# Altium schematic sheet Power.SchDoc
size A4
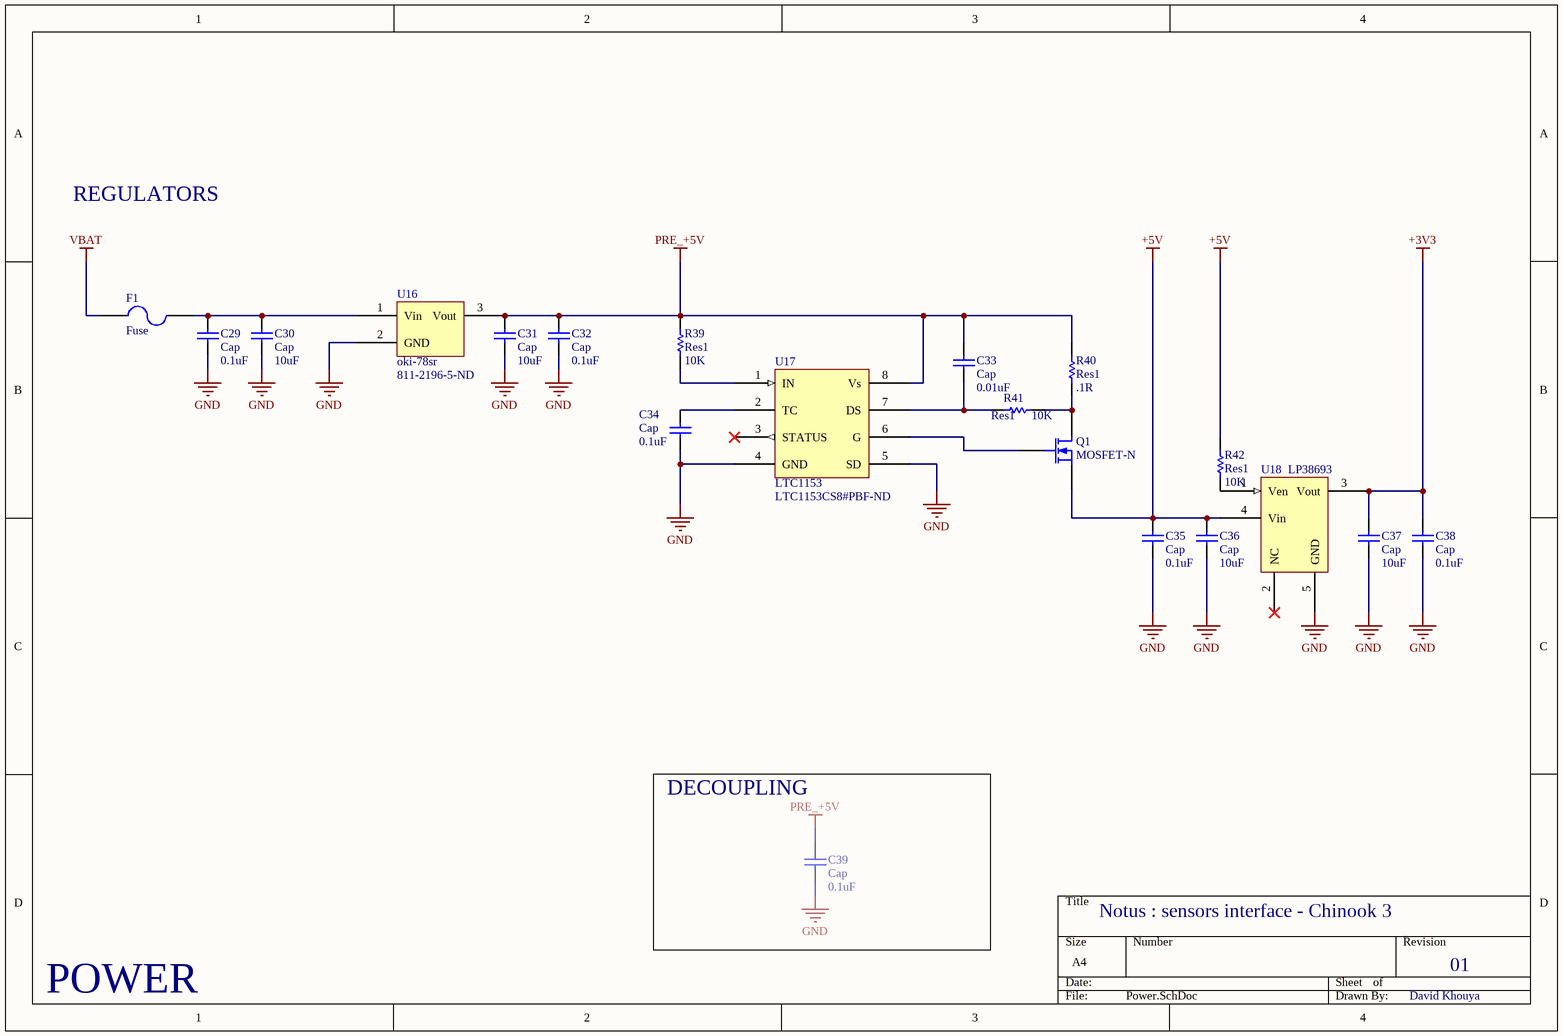
[diagram p0: Power.SchDoc]

## Parts
C29  Cap  value 0.1uF  [RESC2012N]
C30  Cap  value 10uF  [RESC2012N]
C31  Cap  value 10uF  [RESC2012N]
C32  Cap  value 0.1uF  [RESC2012N]
C33  Cap  value 0.01uF  [RESC2012N]
C34  Cap  value 0.1uF  [RESC2012N]
C35  Cap  value 0.1uF  [RESC2012N]
C36  Cap  value 10uF  [RESC2012N]
C37  Cap  value 10uF  [RESC2012N]
C38  Cap  value 0.1uF  [RESC2012N]
C39  Cap  value 0.1uF  [RESC2012N]
F1  Fuse  [Fuse Holder 656]
Q1  MOSFET-N  [SOT223-4M]
R39  Res1  value 10K  [RESC2012N]
R40  Res1  value .1R  [RESC2012N]
R41  Res1  value 10K  [RESC2012N]
R42  Res1  value 10K  [RESC2012N]
U16  oki-78sr  Supplier Part Number 1: 811-2196-5-ND  [oki-78sr]
U17  LTC1153  Supplier Part Number 1: LTC1153CS8#PBF-ND  [8SOIC-2]
U18  LP38693  [SOT223-5M]

## Blocks framed on the sheet
DECOUPLING: C39

## Nets
+3V3: C37.2 C38.2 U18.3(Vout)
+5V: C35.2 C36.2 Q1.3(S) R42.2 U18.4(Vin)
GND: C29.1 C30.1 C31.1 C32.1 C34.1 C35.1 C36.1 C37.1 C38.1 C39.1 U16.2(GND) U17.4(GND) U17.5(SD) U18.5(GND)
PRE_+5V: C31.2 C32.2 C33.2 C39.2 R39.2 R40.1 U16.3(Vout) U17.8(Vs)
VBAT: F1.1
NetC29_2: C29.2 C30.2 F1.2 U16.1(Vin)
NetC33_1: C33.1 R41.1 U17.7(DS)
NetC34_2: C34.2 U17.2(TC)
NetQ1_1: Q1.1(D) R40.2 R41.2
NetQ1_2: Q1.2(G) U17.6(G)
NetR39_1: R39.1 U17.1(IN)
NetR42_1: R42.1 U18.1(Ven)

Not connected (* = marked no-connect by the designer): U17 3(STATUS)*; U18 2(NC)*

## Notes on the sheet
- REGULATORS
- Notus : sensors interface - Chinook 3
- 01
- POWER
- David Khouya

## Library data of the parts
C29-C39 = Cap: Capacitor; Published: 8-Jun-2000; LatestRevisionDate: 17-Jul-2002; LatestRevisionNote: Re-released for DXP Platform.; PackageReference: RAD-0.3; Publisher: Altium Limited; PackageDescription: Radial Cap, Thru-Hole; 2 Leads; 0.3 in Pin Spacing
F1 = Fuse 2: Published: 8-Jun-2000; LatestRevisionDate: 17-Jul-2002; LatestRevisionNote: Re-released for DXP Platform.; PackageReference: PIN-W2/E2.8; Publisher: Altium Limited; PackageDescription: Thru-Hole; 2 Leads
Q1 = MOSFET-N: N-Channel MOSFET; pin to pad: 1>2 2>1; Published: 8-Jun-2000; LatestRevisionDate: 17-Jul-2002; LatestRevisionNote: Re-released for DXP Platform.; PackageVersion: 1995/1996; PackageReference: E3; Publisher: Altium Limited; PackageDescription: TO, Flat Index; 3 In-Line, Axial Leads; Body Dia. 4.6mm; Lead Dia. 0.5 mm (max)
R39-R42 = Res1: Resistor; Published: 8-Jun-2000; LatestRevisionDate: 17-Jul-2002; LatestRevisionNote: Re-released for DXP Platform.; PackageReference: AXIAL-0.3; Publisher: Altium Limited; PackageDescription: Axial Device, Thru-Hole; 2 Leads; 0.3 in Pin Spacing
U16 = oki-78sr: 5V 1.5A (Vin 7V-36V) swiching power supply - board mount; Supplier 1: Digi-Key
U17 = LTC1153: Over current protection - Circuit breaker; Supplier 1: Digi-Key
U18 = LP38693: LDO 3.3V 500mA